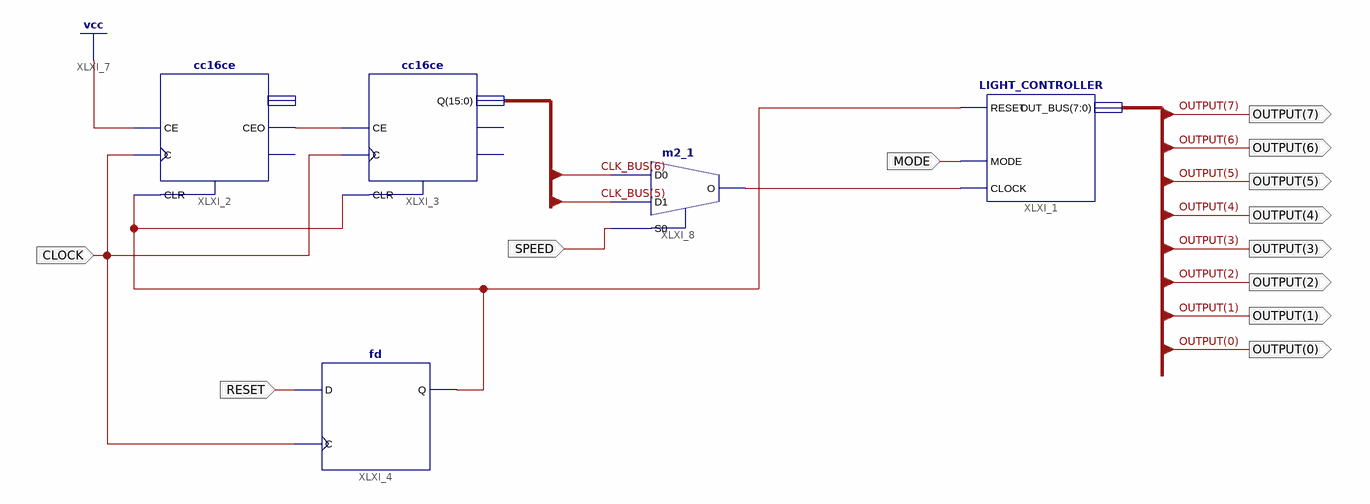
[diagram p0: schematic sheet 1]
// Xilinx ISE schematic TOP_SCHEME.sch (spartan3a) as structural Verilog: 5 symbols, 12 ports
module TOP_SCHEME (
  input  CLOCK,
  input  RESET,
  input  SPEED,
  input  MODE,
  output [7:0] OUTPUT
);

  wire XLXN_10, XLXN_14, XLXN_36;
  wire [15:0] CLK_BUS;

  cc16ce XLXI_2 (.C(CLOCK), .CE(1'b1), .CLR(XLXN_14), .CEO(XLXN_10));  // open: Q, TC
  cc16ce XLXI_3 (.C(CLOCK), .CE(XLXN_10), .CLR(XLXN_14), .Q(CLK_BUS));  // open: CEO, TC
  fd XLXI_4 (.C(CLOCK), .D(RESET), .Q(XLXN_14));
  m2_1 XLXI_8 (.D0(CLK_BUS[6]), .D1(CLK_BUS[5]), .S0(SPEED), .O(XLXN_36));
  LIGHT_CONTROLLER XLXI_1 (.RESET(XLXN_14), .MODE(MODE), .OUT_BUS(OUTPUT), .CLOCK(XLXN_36));
endmodule
